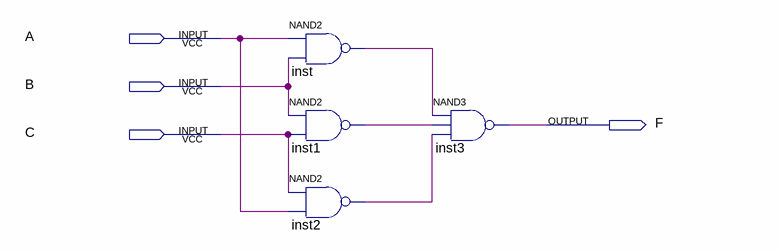
[diagram p0: schematic sheet]
// Quartus schematic firebibobibo.bdf as structural Verilog: 4 symbols, 4 pins
module firebibobibo (
  input  A,
  input  B,
  input  C,
  output F
);

  wire inst1_out, inst2_out, inst_out;

  nand inst (inst_out, A, B);
  nand inst1 (inst1_out, B, C);
  nand inst2 (inst2_out, C, A);
  nand inst3 (F, inst_out, inst1_out, inst2_out);
endmodule
